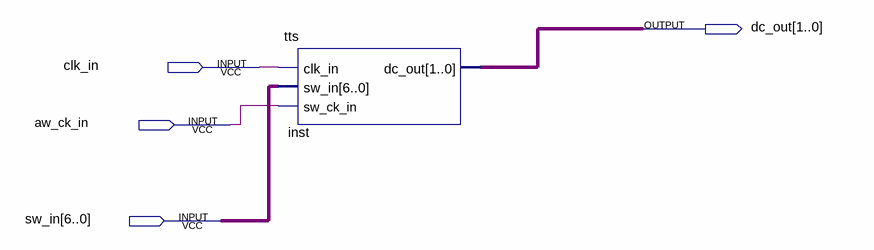
[diagram p0: schematic sheet]
// Quartus schematic tts_bdf.bdf as structural Verilog: 1 symbols, 4 pins
module tts_bdf (
  input  clk_in,
  input  aw_ck_in,
  input  [6:0] sw_in,
  output [1:0] dc_out
);

  tts inst (.clk_in(clk_in), .sw_in(sw_in), .sw_ck_in(aw_ck_in), .dc_out(dc_out));
endmodule
